# EAGLE schematic scheme (EAGLE 9.3.2)
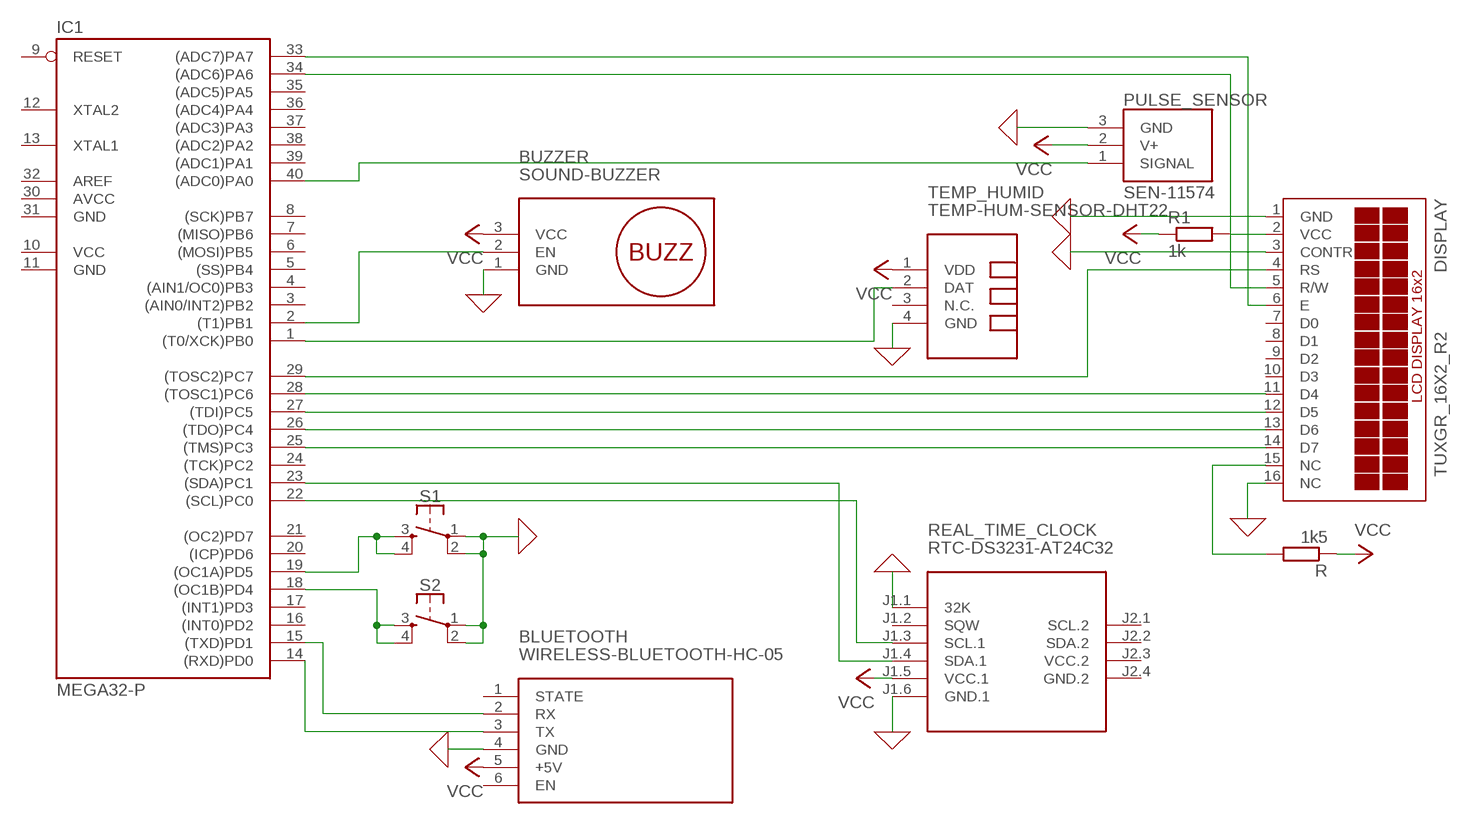
[diagram p0: schematic, sheet 1]

## Parts
BLUETOOTH  WIRELESS-BLUETOOTH-HC-05  [WIRELESS-BLUETOOTH-HC-05]
BUZZER  SOUND-BUZZER  [SOUND-BUZZER]
DISPLAY  TUXGR_16X2_R2  [TUXGR_16X2_R2]
IC1  MEGA32-P  [DIL40]
PULSE_SENSOR  SEN-11574  [XDCR_SEN-11574]
R  1k5  R-EU_0204/5  [0204/5]
R1  1k  R-EU_0204/5  [0204/5]
REAL_TIME_CLOCK  RTC-DS3231-AT24C32  [RTC-DS3231-AT24C32]
S1  MOMENTARY-SWITCH-SPST-2-SMD-4.6X2.8MM  [TACTILE_SWITCH_SMD_4.6X2.8MM]
S2  MOMENTARY-SWITCH-SPST-2-SMD-4.6X2.8MM  [TACTILE_SWITCH_SMD_4.6X2.8MM]
TEMP_HUMID  TEMP-HUM-SENSOR-DHT22  [TEMP-HUM-SENSOR-DHT22]

## Nets
0: BLUETOOTH.4(GND) BUZZER.1(GND) DISPLAY.1(GND) DISPLAY.3(CONTR) DISPLAY.16(NC) PULSE_SENSOR.3(GND) REAL_TIME_CLOCK.J1.1(32K) REAL_TIME_CLOCK.J1.6(GND.1) S1.1 S1.2 S2.1 S2.2 TEMP_HUMID.4(GND) ; supply symbol labelled GND
N$1: DISPLAY.14(D7) IC1.25((TMS)PC3)
N$2: DISPLAY.13(D6) IC1.26((TDO)PC4)
N$3: DISPLAY.12(D5) IC1.27((TDI)PC5)
N$4: DISPLAY.11(D4) IC1.28((TOSC1)PC6)
N$5: DISPLAY.4(RS) IC1.29((TOSC2)PC7)
N$6: DISPLAY.6(E) IC1.33((ADC7)PA7)
N$7: DISPLAY.5(R/W) IC1.34((ADC6)PA6)
N$8: IC1.22((SCL)PC0) REAL_TIME_CLOCK.J1.3(SCL.1)
N$9: DISPLAY.2(VCC) R1.2
N$10: IC1.40((ADC0)PA0) PULSE_SENSOR.1(SIGNAL)
N$11: IC1.1((T0/XCK)PB0) TEMP_HUMID.2(DAT)
N$12: IC1.23((SDA)PC1) REAL_TIME_CLOCK.J1.4(SDA.1)
N$13: DISPLAY.15(NC) R.2
N$14: BUZZER.2(EN) IC1.2((T1)PB1)
N$15: BLUETOOTH.3(TX) IC1.14((RXD)PD0)
N$16: BLUETOOTH.2(RX) IC1.15((TXD)PD1)
N$18: IC1.18((OC1B)PD4) S2.3 S2.4
N$20: IC1.19((OC1A)PD5) S1.3 S1.4
VCC: BLUETOOTH.5(+5V) BUZZER.3(VCC) PULSE_SENSOR.2(V+) R1.1 R.1 REAL_TIME_CLOCK.J1.5(VCC.1) TEMP_HUMID.1(VDD)
Unconnected: BLUETOOTH.1(STATE) BLUETOOTH.6(EN) DISPLAY.7(D0) DISPLAY.8(D1) DISPLAY.9(D2) DISPLAY.10(D3) IC1.3((AIN0/INT2)PB2) IC1.4((AIN1/OC0)PB3) IC1.5((SS)PB4) IC1.6((MOSI)PB5) IC1.7((MISO)PB6) IC1.8((SCK)PB7) IC1.9(RESET) IC1.12(XTAL2) IC1.13(XTAL1) IC1.16((INT0)PD2) IC1.17((INT1)PD3) IC1.20((ICP)PD6) IC1.21((OC2)PD7) IC1.24((TCK)PC2) IC1.32(AREF) IC1.35((ADC5)PA5) IC1.36((ADC4)PA4) IC1.37((ADC3)PA3) IC1.38((ADC2)PA2) IC1.39((ADC1)PA1) REAL_TIME_CLOCK.J1.2(SQW) REAL_TIME_CLOCK.J2.1(SCL.2) REAL_TIME_CLOCK.J2.2(SDA.2) TEMP_HUMID.3(N.C.)

## Power pins joined to a net without a drawn wire
AVCC: IC1.30(AVCC)
GND: IC1.11(GND) IC1.31(GND)
GND.2: REAL_TIME_CLOCK.J2.4(GND.2)
VCC: IC1.10(VCC)
VCC.2: REAL_TIME_CLOCK.J2.3(VCC.2)

## Library data of the parts
BLUETOOTH = diy-modules:WIRELESS-BLUETOOTH-HC-05: Bluetooth Transceiver Module based on HC-05 board Tutorial is available here: https://arduino-info.wikispaces.com/BlueTooth-HC05-HC06-Modules-How-To Click here to find device on ebay.com <http://www.ebay.com/sch/hc-05+module+rs232>
BUZZER = diy-modules:SOUND-BUZZER: Sound Buzzer Module Click here to find device on ebay.com <http://www.ebay.com/sch/passive+buzzer+beep+module>
DISPLAY = display-lcd:TUXGR_16X2_R2: Tuxgraphics LCD display 16x2 characters reflective, without background light Source: tuxgr_12x2_r2.pdf; OC_FARNELL: unknown; OC_NEWARK: unknown
IC1 = atmel:MEGA32-P: MICROCONTROLLER 32 Kbytes FLASH 2 Kbytes SRAM 1 Kbytes EEPROM USART 8-channel 10 bit ADC Source: www.atmel.com .. doc2503.pdf; MPN: ATMEGA32-16PU; OC_FARNELL: 1661729; OC_NEWARK: 51P1794
PULSE_SENSOR = SEN-11574:SEN-11574: Pulse Sensor For Arduino; AVAILABILITY: Unavailable; DESCRIPTION: Pulse Sensor For Arduino; MF: SparkFun; MP: SEN-11574; PACKAGE: None; PRICE: None
R R1 = rcl:R-EU_: RESISTOR, European symbol; SPICEPREFIX: R
REAL_TIME_CLOCK = diy-modules:RTC-DS3231-AT24C32: RTC Module with Battery and EEPROM based on DS3231 and AT24C32 chips Tutorial can be found here: https://edwardmallon.wordpress.com/2014/05/21/using-a-cheap-3-ds3231-rtc-at24c32-eeprom-from-ebay/ Click here to find device on ebay.com <http://www.ebay.com/sch/DS3231+AT24C32+module>
S1 S2 = SparkFun-Switches:MOMENTARY-SWITCH-SPST-2: Momentary Switch (Pushbutton) - SPST - Two Circuits Normally-open (NO) SPST momentary switches (buttons, pushbuttons). Schematic symbol includes two switch circuits. Variants SMD-4.6MMX2.8MM - 4.60mm x 2.80mm Tactile Momentary Button Switch - Used on SparkFun SAMD21 Mini Breakout <https://www.sparkfun.com/products/13664> SMD-5.2MM - Mini Pushbutton Switch - SMD <https://www.sparkfun.com/products/8720> - Used on Arduino Pro Mini <https://www.sparkfun.com/products/11114>; PROD_ID: SWCH-13065
TEMP_HUMID = diy-modules:TEMP-HUM-SENSOR-DHT22: DHT22 - digital humidity & temperature sensor Also known as: AM2302 AM2302 datasheet available here: http://akizukidenshi.com/download/ds/aosong/AM2302.pdf Click here to find device on ebay.com <http://www.ebay.com/sch/dht22+digital+sensor>